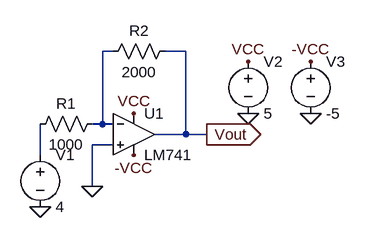
[diagram p0: schematic lab4_task2_part1_4.asc]
lab4_task2_part1_4.asc, the LTspice schematic file:
Version 4.1
SHEET 1 880 680
WIRE 112 48 96 48
WIRE 224 48 192 48
WIRE 96 160 96 48
WIRE 96 160 80 160
WIRE 112 160 96 160
WIRE 224 176 224 48
WIRE 224 176 176 176
WIRE 256 176 224 176
WIRE 112 192 80 192
WIRE 0 208 0 160
WIRE 80 256 80 192
FLAG 0 288 0
FLAG 320 144 0
FLAG 416 144 0
FLAG 320 64 VCC
FLAG 144 144 VCC
FLAG 416 64 -VCC
FLAG 144 208 -VCC
FLAG 256 176 Vout
IOPIN 256 176 Out
FLAG 80 256 0
SYMBOL res 96 144 R90
WINDOW 0 0 56 VBottom 2
WINDOW 3 32 56 VTop 2
SYMATTR InstName R1
SYMATTR Value 1000
SYMBOL res 208 32 R90
WINDOW 0 0 56 VBottom 2
WINDOW 3 32 56 VTop 2
SYMATTR InstName R2
SYMATTR Value 2000
SYMBOL voltage 0 192 R0
WINDOW 123 0 0 Left 0
WINDOW 39 0 0 Left 0
SYMATTR InstName V1
SYMATTR Value 4
SYMBOL voltage 320 48 R0
WINDOW 123 0 0 Left 0
WINDOW 39 0 0 Left 0
SYMATTR InstName V2
SYMATTR Value 5
SYMBOL voltage 416 48 R0
WINDOW 123 0 0 Left 0
WINDOW 39 0 0 Left 0
SYMATTR InstName V3
SYMATTR Value -5
SYMBOL LM741 144 112 R0
SYMATTR InstName U1

The netlist it stands for:
* lab4_task2_part1_4.asc
R1 N001 N002 1000
R2 Vout N001 2000
V1 N002 0 4
V2 VCC 0 5
V3 -VCC 0 -5
X§U1 0 N001 VCC -VCC Vout LM741  ; pins In+ In- V+ V- OUT
.lib LM741.lib
.backanno
.end